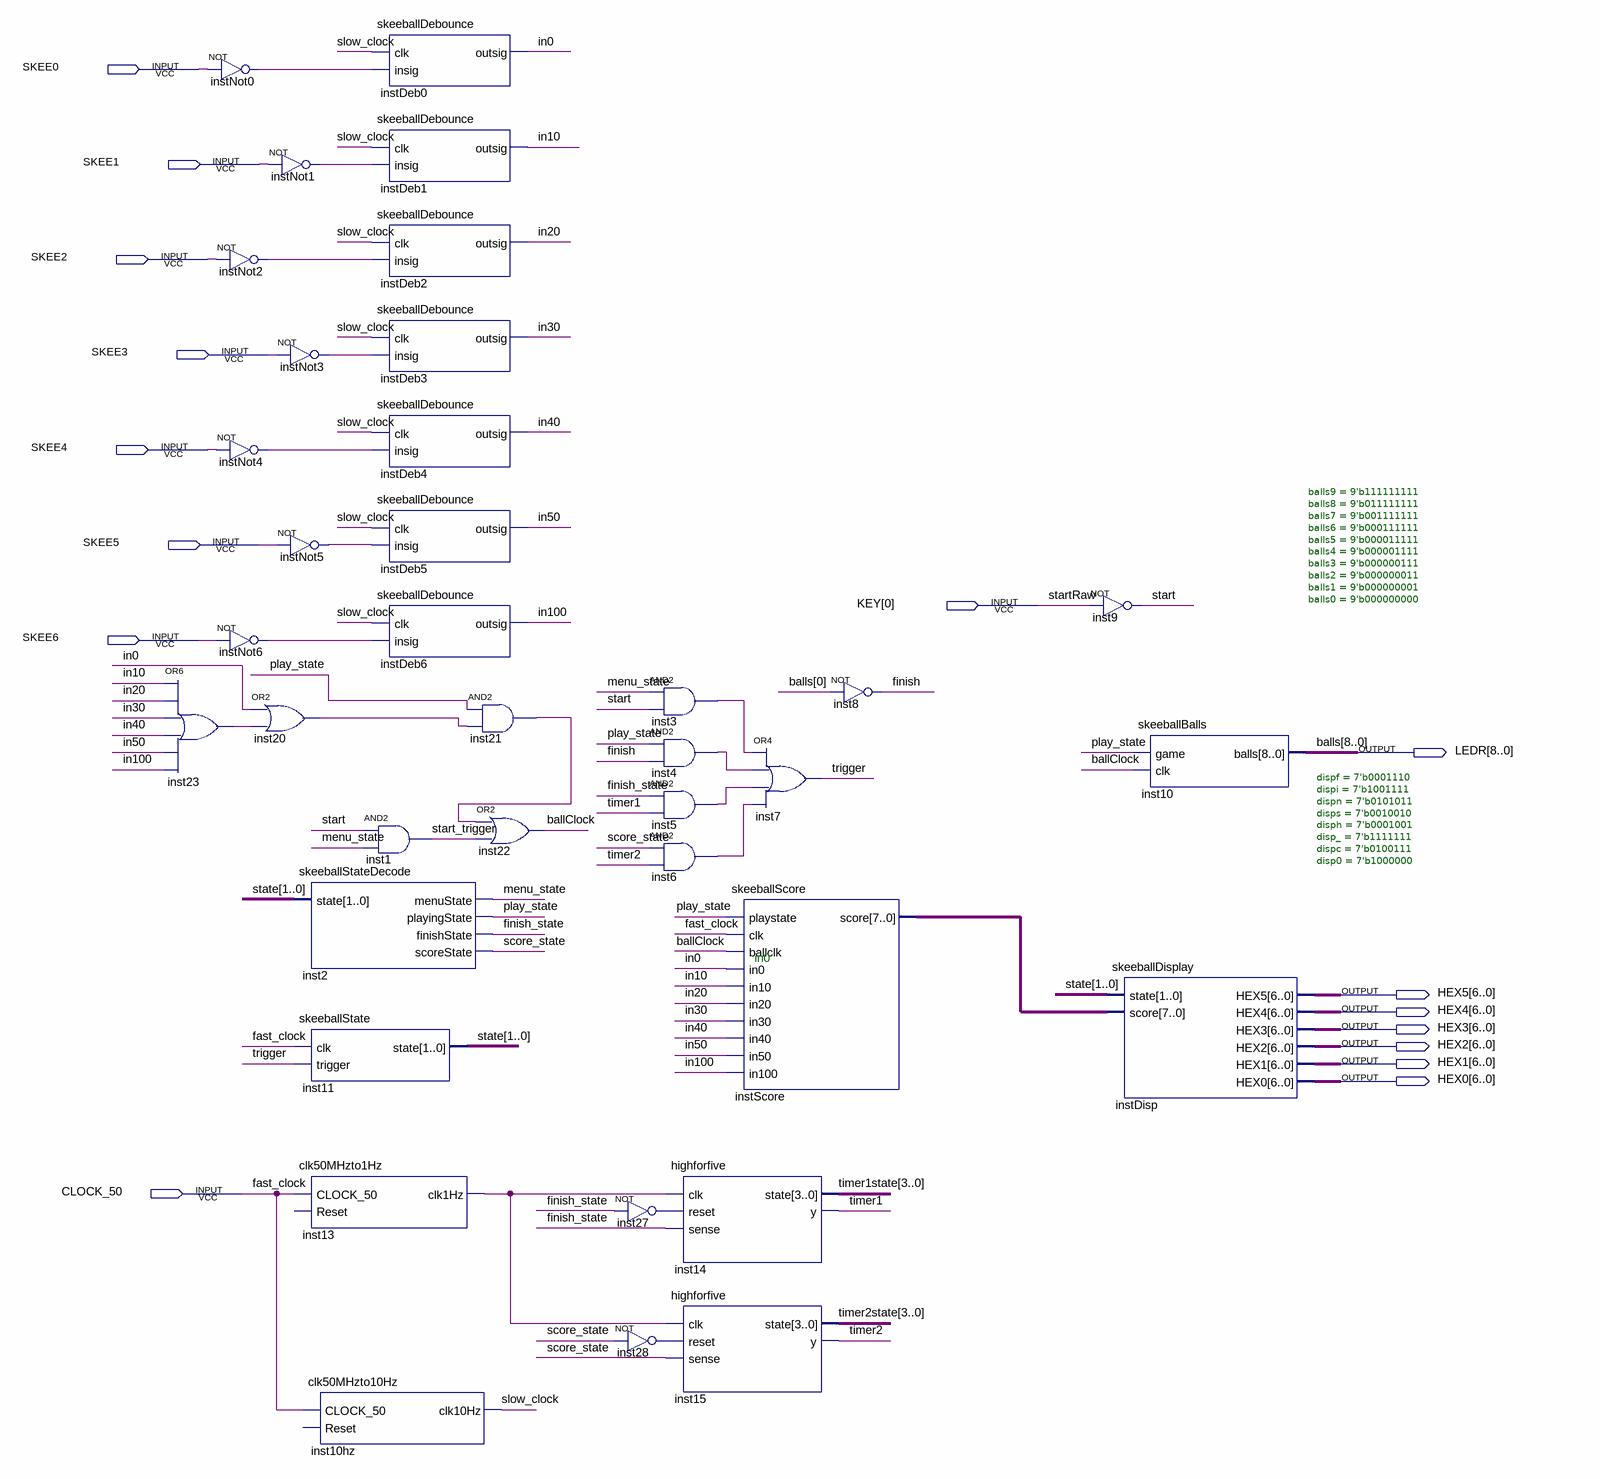
[diagram p0: schematic sheet]
// Quartus schematic SkeeballFinal.bdf as structural Verilog: 37 symbols, 16 pins
module SkeeballFinal (
  input  SKEE0,
  input  SKEE1,
  input  SKEE2,
  input  SKEE3,
  input  SKEE4,
  input  SKEE5,
  input  [0:0] KEY,
  input  SKEE6,
  input  CLOCK_50,
  output [8:0] LEDR,
  output [6:0] HEX5,
  output [6:0] HEX4,
  output [6:0] HEX3,
  output [6:0] HEX2,
  output [6:0] HEX1,
  output [6:0] HEX0
);

  wire ballClock, finish, finish_state, in0, in10, in20, in30, in40, in50, in100, inst3_out, inst4_out,
       inst5_out, inst6_out, inst13_clk1hz, inst20_out, inst21_out, inst23_out, inst27_out, inst28_out,
       instNot0_out, instNot1_out, instNot2_out, instNot3_out, instNot4_out, instNot5_out, instNot6_out,
       menu_state, play_state, score_state, slow_clock, start, start_trigger, timer1, timer2, trigger;
  wire [1:0] state;
  wire [3:0] timer1state, timer2state;
  wire [7:0] instScore_score;

  not instNot0 (instNot0_out, SKEE0);
  or inst23 (inst23_out, in10, in20, in30, in40, in50, in100);
  not instNot1 (instNot1_out, SKEE1);
  not instNot2 (instNot2_out, SKEE2);
  not instNot3 (instNot3_out, SKEE3);
  not instNot4 (instNot4_out, SKEE4);
  not instNot5 (instNot5_out, SKEE5);
  not instNot6 (instNot6_out, SKEE6);
  or inst20 (inst20_out, in0, inst23_out);
  skeeballStateDecode inst2 (
    .state(state), .menuState(menu_state), .playingState(play_state), .finishState(finish_state),
    .scoreState(score_state));
  skeeballState inst11 (.clk(CLOCK_50), .trigger(trigger), .state(state));
  clk50MHzto1Hz inst13 (.CLOCK_50(CLOCK_50), .clk1Hz(inst13_clk1hz));  // open: Reset
  clk50MHzto10Hz inst10hz (.CLOCK_50(CLOCK_50), .clk10Hz(slow_clock));  // open: Reset
  skeeballDebounce instDeb0 (.clk(slow_clock), .insig(instNot0_out), .outsig(in0));
  skeeballDebounce instDeb1 (.clk(slow_clock), .insig(instNot1_out), .outsig(in10));
  skeeballDebounce instDeb2 (.clk(slow_clock), .insig(instNot2_out), .outsig(in20));
  skeeballDebounce instDeb3 (.clk(slow_clock), .insig(instNot3_out), .outsig(in30));
  skeeballDebounce instDeb4 (.clk(slow_clock), .insig(instNot4_out), .outsig(in40));
  skeeballDebounce instDeb5 (.clk(slow_clock), .insig(instNot5_out), .outsig(in50));
  skeeballDebounce instDeb6 (.clk(slow_clock), .insig(instNot6_out), .outsig(in100));
  and inst1 (start_trigger, start, menu_state);
  and inst21 (inst21_out, play_state, inst20_out);
  or inst22 (ballClock, inst21_out, start_trigger);
  not inst27 (inst27_out, finish_state);
  not inst28 (inst28_out, score_state);
  and inst3 (inst3_out, menu_state, start);
  and inst4 (inst4_out, play_state, finish);
  and inst5 (inst5_out, finish_state, timer1);
  and inst6 (inst6_out, score_state, timer2);
  highforfive inst14 (.clk(inst13_clk1hz), .reset(inst27_out), .sense(finish_state), .state(timer1state), .y(timer1));
  highforfive inst15 (.clk(inst13_clk1hz), .reset(inst28_out), .sense(score_state), .state(timer2state), .y(timer2));
  or inst7 (trigger, inst3_out, inst4_out, inst5_out, inst6_out);
  skeeballScore instScore (
    .playstate(play_state), .clk(CLOCK_50), .ballclk(ballClock), .in0(in0), .in10(in10), .in20(in20),
    .in30(in30), .in40(in40), .in50(in50), .in100(in100), .score(instScore_score));
  not inst8 (finish, LEDR[0]);
  not inst9 (start, KEY[0]);
  skeeballDisplay #(.dispf(7'b0001110), .dispi(7'b1001111), .dispn(7'b0101011), .disps(7'b0010010), .disph(7'b0001001), .disp_(7'b1111111), .dispc(7'b0100111), .disp0(7'b1000000)) instDisp (
    .state(state), .score(instScore_score), .HEX5(HEX5), .HEX4(HEX4), .HEX3(HEX3), .HEX2(HEX2), .HEX1(HEX1),
    .HEX0(HEX0));
  skeeballBalls #(.balls9(9'b111111111), .balls8(9'b011111111), .balls7(9'b001111111), .balls6(9'b000111111), .balls5(9'b000011111), .balls4(9'b000001111), .balls3(9'b000000111), .balls2(9'b000000011), .balls1(9'b000000001), .balls0(9'b000000000)) inst10 (
    .game(play_state), .clk(ballClock), .balls(LEDR));

  // Other names for the same wires on the sheet: balls[8:0] = LEDR; fast_clock = CLOCK_50; startRaw = KEY[0]

  // Notes on the sheet:
  //   in0
endmodule
